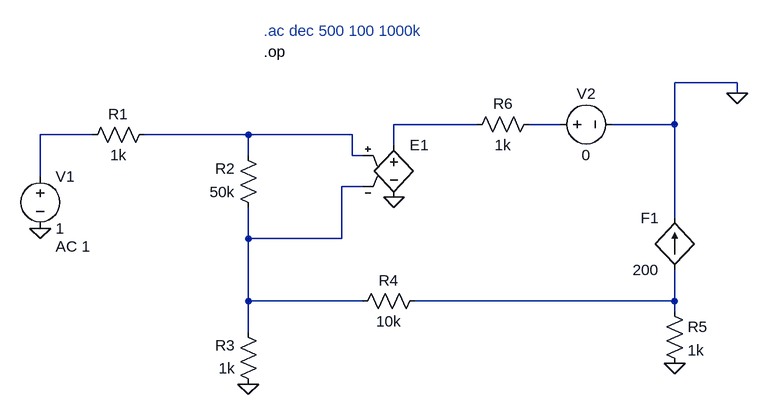
[diagram p0: schematic Transferencia3.asc]
Transferencia3.asc, the LTspice schematic file:
Version 4
SHEET 1 1012 1092
WIRE 768 48 672 48
WIRE 768 64 768 48
WIRE 368 112 240 112
WIRE 496 112 448 112
WIRE 672 112 672 48
WIRE 672 112 576 112
WIRE -224 128 -304 128
WIRE 16 128 -144 128
WIRE 176 128 16 128
WIRE 240 144 240 112
WIRE 16 160 16 128
WIRE 176 160 176 128
WIRE 192 160 176 160
WIRE -304 192 -304 128
WIRE 192 208 160 208
WIRE 672 256 672 112
WIRE 16 288 16 240
WIRE 160 288 160 208
WIRE 160 288 16 288
WIRE 16 384 16 288
WIRE 192 384 16 384
WIRE 672 384 672 336
WIRE 672 384 272 384
WIRE 672 400 672 384
WIRE 16 432 16 384
FLAG 240 224 0
FLAG -304 272 0
FLAG 768 64 0
FLAG 16 512 0
FLAG 672 480 0
DATAFLAG 672 368 ""
SYMBOL e 240 128 R0
WINDOW 3 24 96 Invisible 2
SYMATTR Value -10/(1+s/62831.8)
SYMATTR InstName E1
SYMATTR SpiceModel laplace
SYMBOL voltage -304 176 R0
WINDOW 123 24 124 Left 2
WINDOW 39 0 0 Left 0
SYMATTR Value2 AC 1
SYMATTR InstName V1
SYMATTR Value 1
SYMBOL res -128 112 R90
WINDOW 0 0 56 VBottom 2
WINDOW 3 32 56 VTop 2
SYMATTR InstName R1
SYMATTR Value 1k
SYMBOL res 32 256 R180
WINDOW 0 36 76 Left 2
WINDOW 3 36 40 Left 2
SYMATTR InstName R2
SYMATTR Value 50k
SYMBOL res 32 528 R180
WINDOW 0 36 76 Left 2
WINDOW 3 36 40 Left 2
SYMATTR InstName R3
SYMATTR Value 1k
SYMBOL res 176 400 R270
WINDOW 0 32 56 VTop 2
WINDOW 3 0 56 VBottom 2
SYMATTR InstName R4
SYMATTR Value 10k
SYMBOL res 656 384 R0
SYMATTR InstName R5
SYMATTR Value 1k
SYMBOL res 464 96 R90
WINDOW 0 0 56 VBottom 2
WINDOW 3 32 56 VTop 2
SYMATTR InstName R6
SYMATTR Value 1k
SYMBOL voltage 480 112 R270
WINDOW 0 32 56 VTop 2
WINDOW 3 -32 56 VBottom 2
WINDOW 123 0 0 Left 0
WINDOW 39 0 0 Left 0
SYMATTR InstName V2
SYMATTR Value 0
SYMBOL f 672 336 R180
WINDOW 0 24 80 Left 2
WINDOW 3 24 0 Left 2
SYMATTR InstName F1
SYMATTR Value 200
SYMATTR SpiceModel v2
TEXT 40 0 Left 2 !.op
TEXT 40 -32 Left 2 ;.ac dec 500 100 1000k

The netlist it stands for:
* Transferencia3.asc
E1 N001 0 N004 N005 laplace -10/(1+s/62831.8)
V1 N003 0 1 AC 1
R1 N004 N003 1k
R2 N005 N004 50k
R3 0 N005 1k
R4 N005 N006 10k
R5 N006 0 1k
R6 N002 N001 1k
V2 N002 0 0
F1 N006 0 v2 200
.op
* .ac dec 500 100 1000k
.backanno
.end